# EAGLE design CntrlBoard (EAGLE 6.5.0)
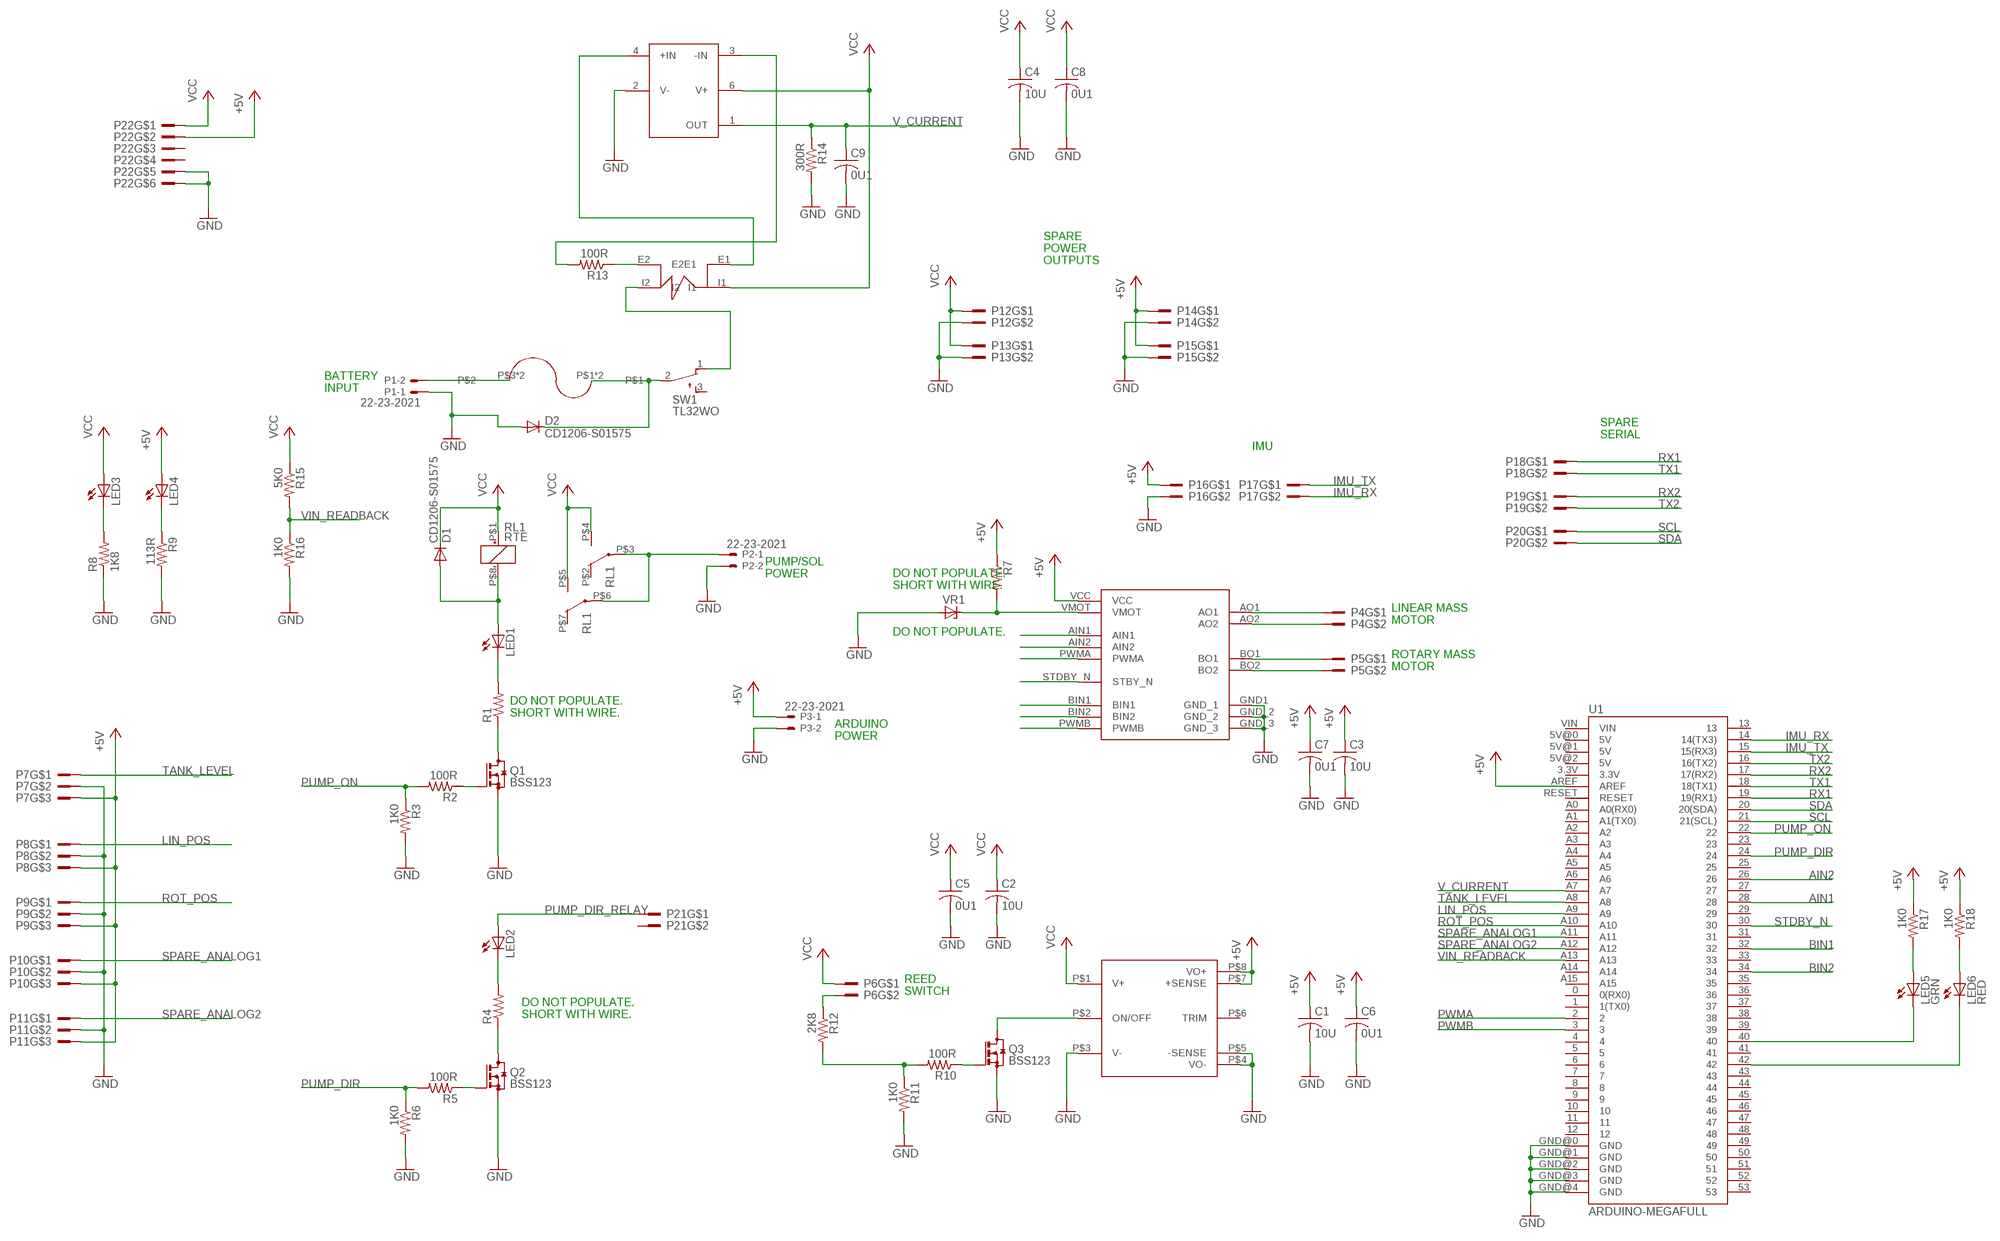
[diagram p0: schematic, sheet 1]

## Parts
C1  10U  C-USC1210K  [C1210K]
C2  10U  C-USC1210K  [C1210K]
C3  10U  C-USC1210K  [C1210K]
C4  10U  C-USC1210K  [C1210K]
C5  0U1  C-USC1210K  [C1210K]
C6  0U1  C-USC1210K  [C1210K]
C7  0U1  C-USC1210K  [C1210K]
C8  0U1  C-USC1210K  [C1210K]
C9  0U1  C-USC1210K  [C1210K]
D1  CD1206-S01575  [CD1206]
D2  CD1206-S01575  [CD1206]
LED1  LEDCHIPLED_1206  [CHIPLED_1206]
LED2  LEDCHIPLED_1206  [CHIPLED_1206]
LED3  LEDCHIPLED_1206  [CHIPLED_1206]
LED4  LEDCHIPLED_1206  [CHIPLED_1206]
LED5  GRN  LEDCHIPLED_1206  [CHIPLED_1206]
LED6  RED  LEDCHIPLED_1206  [CHIPLED_1206]
P1  22-23-2021  [22-23-2021]
P2  22-23-2021  [22-23-2021]
P3  22-23-2021  [22-23-2021]
P4  DF3A-2P-2DSA  [DF3A-2P-2DSA]
P5  DF3A-2P-2DSA  [DF3A-2P-2DSA]
P6  DF3A-2P-2DSA  [DF3A-2P-2DSA]
P7  3MM2MMLOCKING  [3PIN_2MMLOCKING]
P8  3MM2MMLOCKING  [3PIN_2MMLOCKING]
P9  3MM2MMLOCKING  [3PIN_2MMLOCKING]
P10  3MM2MMLOCKING  [3PIN_2MMLOCKING]
P11  3MM2MMLOCKING  [3PIN_2MMLOCKING]
P12  DF3A-2P-2DSA  [DF3A-2P-2DSA]
P13  DF3A-2P-2DSA  [DF3A-2P-2DSA]
P14  DF3A-2P-2DSA  [DF3A-2P-2DSA]
P15  DF3A-2P-2DSA  [DF3A-2P-2DSA]
P16  DF3A-2P-2DSA  [DF3A-2P-2DSA]
P17  DF3A-2P-2DSA  [DF3A-2P-2DSA]
P18  DF3A-2P-2DSA  [DF3A-2P-2DSA]
P19  DF3A-2P-2DSA  [DF3A-2P-2DSA]
P20  DF3A-2P-2DSA  [DF3A-2P-2DSA]
P21  DF3A-2P-2DSA  [DF3A-2P-2DSA]
P22  6PIN2ROWARDUINO  [6PIN2ROWARDUINO]
PS1  KHHD006A0A41Z  [KHHD006A0A41Z]
Q1  BSS123  [SOT23]
Q2  BSS123  [SOT23]
Q3  BSS123  [SOT23]
R1  R-US_R1206  [R1206]
R2  100R  R-US_R1206  [R1206]
R3  1K0  R-US_R1206  [R1206]
R4  R-US_R1206  [R1206]
R5  100R  R-US_R1206  [R1206]
R6  1K0  R-US_R1206  [R1206]
R7  R-US_R1206  [R1206]
R8  1K8  R-US_R1210  [R1210]
R9  113R  R-US_R1206  [R1206]
R10  100R  R-US_R1206  [R1206]
R11  1K0  R-US_R1206  [R1206]
R12  2K8  R-US_R1206  [R1206]
R13  100R  R-US_R1206  [R1206]
R14  300R  R-US_R1206  [R1206]
R15  5K0  R-US_R1206  [R1206]
R16  1K0  R-US_R1206  [R1206]
R17  1K0  R-US_R1206  [R1206]
R18  1K0  R-US_R1206  [R1206]
RL1  RTE  [RTE]
SW1  TL32WO  [TL3XWO]
U1  ARDUINO-MEGAFULL  [ARDUINO_MEGA]
U$1  ATC_FUSE_HOLDER  [FUSE_HOLDER_ATC]
U$2  POLOLU713  [POLOLU713]
U$3  RSHUNT  [CM2512SHUNT]
U$4  LT6106  [TSOT23-6]
VR1  ZENER-DIODESOT23  [SOT23]

## Nets
+5V: C1.1 C3.1 C6.1 C7.1 LED4.A P3.1 P7.P$3 P8.P$3 P9.P$3 P10.P$3 P11.P$3 P14.P$1 P15.P$1 P16.P$1 P22.P$2 PS1.P$7(+SENSE) PS1.P$8(VO+) R7.1 R17.1 R18.1 U1.AREF U$2.VCC
AIN1: U1.28 U$2.AIN1
AIN2: U1.26 U$2.AIN2
BIN1: U1.32 U$2.BIN1
BIN2: U1.34 U$2.BIN2
GND: C1.2 C2.2 C3.2 C4.2 C5.2 C6.2 C7.2 C8.2 C9.2 D2.A P1.1 P2.2 P3.2 P7.P$2 P8.P$2 P9.P$2 P10.P$2 P11.P$2 P12.P$2 P13.P$2 P14.P$2 P15.P$2 P16.P$2 P22.P$5 P22.P$6 PS1.P$3(V-) PS1.P$4(VO-) PS1.P$5(-SENSE) Q1.2(S) Q2.2(S) Q3.2(S) R3.2 R6.2 R8.1 R9.2 R11.2 R14.2 R16.2 U1.GND@0(GND) U1.GND@1(GND) U1.GND@2(GND) U1.GND@3(GND) U1.GND@4(GND) U$2.GND1(GND_1) U$2.GND_2 U$2.GND_3 U$4.2(V-) VR1.1(A)
IMU_RX: P17.P$2 U1.14(14(TX3))
IMU_TX: P17.P$1 U1.15(15(RX3))
LIN_POS: P8.P$1 U1.A9
N$1: P1.2 U$1.P$3 U$1.P$4
N$2: D1.A LED1.A RL1.P$8(-)
N$3: LED5.C U1.40
N$4: P2.1 RL1.P$3(P) RL1.P$6(P)
N$5: LED1.C R1.2
N$6: Q1.3(D) R1.1
N$7: Q2.3(D) R4.1
N$8: Q1.1(G) R2.1
N$9: LED2.C R4.2
N$10: LED4.C R9.1
N$11: Q2.1(G) R5.1
N$12: LED3.C R8.2
N$13: R10.2 R11.1 R12.2
N$14: Q3.1(G) R10.1
N$15: P6.P$2 R12.1
N$16: PS1.P$2(ON/OFF) Q3.3(D)
N$17: P4.P$1 U$2.AO1
N$18: P4.P$2 U$2.AO2
N$19: P5.P$1 U$2.BO1
N$20: P5.P$2 U$2.BO2
N$21: R7.2 U$2.VMOT VR1.3(C)
N$22: SW1.1(O) U$3.I2
N$23: LED6.C U1.42
N$24: R13.1 U$3.E2
N$25: R13.2 U$4.3(-IN)
N$26: U$3.E1 U$4.4(+IN)
N$27: D2.K(C) SW1.2(P) U$1.P$1 U$1.P$2
N$28: LED5.A R17.2
N$29: LED6.A R18.2
PUMP_DIR: R5.2 R6.1 U1.24
PUMP_DIR_RELAY: LED2.A P21.P$1
PUMP_ON: R2.2 R3.1 U1.22
PWMA: U1.2 U$2.PWMA
PWMB: U1.3 U$2.PWMB
ROT_POS: P9.P$1 U1.A10
RX1: P18.P$1 U1.19(19(RX1))
RX2: P19.P$1 U1.17(17(RX2))
SCL: P20.P$1 U1.21(21(SCL))
SDA: P20.P$2 U1.20(20(SDA))
SPARE_ANALOG1: P10.P$1 U1.A11
SPARE_ANALOG2: P11.P$1 U1.A12
STDBY_N: U1.30 U$2.STDBY_N(STBY_N)
TANK_LEVEL: P7.P$1 U1.A8
TX1: P18.P$2 U1.18(18(TX1))
TX2: P19.P$2 U1.16(16(TX2))
V_CURRENT: C9.1 R14.1 U1.A7 U$4.1(OUT)
VCC: C2.1 C4.1 C5.1 C8.1 D1.K(C) LED3.A P6.P$1 P12.P$1 P13.P$1 P22.P$1 PS1.P$1(V+) R15.1 RL1.P$1(+) RL1.P$4(S) RL1.P$5(S) U$3.I1 U$4.6(V+)
VIN_READBACK: R15.2 R16.1 U1.A13
Unconnected: P21.P$2 P22.P$3 P22.P$4 PS1.P$6(TRIM) RL1.P$2(O) RL1.P$7(O) SW1.3(S) U1.0(0(RX0)) U1.1(1(TX0)) U1.3.3V U1.4 U1.5 U1.5V@0(5V) U1.5V@1(5V) U1.5V@2(5V) U1.6 U1.7 U1.8 U1.9 U1.10 U1.11 U1.12 U1.13 U1.23 U1.25 U1.27 U1.29 U1.31 U1.33 U1.35 U1.36 U1.37 U1.38 U1.39 U1.41 U1.43 U1.44 U1.45 U1.46 U1.47 U1.48 U1.49 U1.50 U1.51 U1.52 U1.53 U1.A0(A0(RX0)) U1.A1(A1(TX0)) U1.A2 U1.A3 U1.A4 U1.A5 U1.A6 U1.A14 U1.A15 U1.RESET U1.VIN

## Notes on the sheet
- SPARE
  POWER
  OUTPUTS
- BATTERY
  INPUT
- SPARE
  SERIAL
- IMU
- PUMP/SOL
  POWER
- DO NOT POPULATE.
  SHORT WITH WIRE.
- LINEAR MASS
  MOTOR
- DO NOT POPULATE.
- ROTARY MASS
  MOTOR
- DO NOT POPULATE.
  SHORT WITH WIRE.
- ARDUINO
  POWER
- REED
  SWITCH
- DO NOT POPULATE.
  SHORT WITH WIRE.

## Library data of the parts
C1-C9 = resistor:C-US: CAPACITOR, American symbol
D1 D2 = diode:CD1206-S01575
LED1-LED6 = led:LED: LED OSRAM: - CHIPLED LG R971, LG N971, LY N971, LG Q971, LY Q971, LO R971, LY R971 LH N974, LH R974 LS Q976, LO Q976, LY Q976 LO Q996 - Hyper CHIPLED LW Q18S LB Q993, LB Q99A, LB R99A - SideLED LS A670, LO A670, LY A670, LG A670, LP A670 LB A673, LV A673, LT A673, LW A673 LH A674 LY A675 LS A676, LA A676, LO A676, LY A676, LW A676 LS A679, LY A679, LG A679 - Hyper Micro SIDELED® LS Y876, LA Y876, LO Y876, LY Y876 LT Y87S - SmartLED LW L88C, LW L88S LB L89C, LB L89S, LG L890 LS L89K, LO L89K, LY L89K LS L896, LA L896, LO L896, LY L896 - TOPLED LS T670, LO T670, LY T670, LG T670, LP T670 LSG T670, LSP T670, LSY T670, LOP T670, LYG T670 LG T671, LOG T671, LSG T671 LB T673, LV T673, LT T673, LW T673 LH T674 LS T676, LA T676, LO T676, LY T676, LB T676, LH T676, LSB T676, LW T676 LB T67C, LV T67C, LT T67C, LS T67K, LO T67K, LY T67K, LW E67C LS E67B, LA E67B, LO E67B, LY E67B, LB E67C, LV E67C, LT E67C LW T67C LS T679, LY T679, LG T679 LS T770, LO T770, LY T770, LG T770, LP T770 LB T773, LV T773, LT T773, LW T773 LH T774 LS E675, LA E675, LY E675, LS T675 LS T776, LA T776, LO T776, LY T776, LB T776 LHGB T686 LT T68C, LB T68C - Hyper Mini TOPLED® LB M676 - Mini TOPLED Santana® LG M470 LS M47K, LO M47K, LY M47K Source: http://www.osram.convergy.de LUXEON: - LUMILED® LXK2-PW12-R00, LXK2-PW12-S00, LXK2-PW14-U00, LXK2-PW14-V00 LXK2-PM12-R00, LXK2-PM12-S00, LXK2-PM14-U00 LXK2-PE12-Q00, LXK2-PE12-R00, LXK2-PE12-S00, LXK2-PE14-T00, LXK2-PE14-U00 LXK2-PB12-K00, LXK2-PB12-L00, LXK2-PB12-M00, LXK2-PB14-N00, LXK2-PB14-P00, LXK2-PB14-Q00 LXK2-PR12-L00, LXK2-PR12-M00, LXK2-PR14-Q00, LXK2-PR14-R00 LXK2-PD12-Q00, LXK2-PD12-R00, LXK2-PD12-S00 LXK2-PH12-R00, LXK2-PH12-S00 LXK2-PL12-P00, LXK2-PL12-Q00, LXK2-PL12-R00 Source: www.luxeon.com KINGBRIGHT: KA-3528ASYC Source: www.kingbright.com
P1-P3 = con-molex:22-23-2021: .100" (2.54mm) Center Header - 2 Pin; MF: MOLEX; MPN: 22-23-2021; OC_FARNELL: 1462926; OC_NEWARK: 25C3832
P4-P6 P12-P21 = con-3m:DF3A-2P-2DSA
P7-P11 = con-3m:3MM2MMLOCKING
P22 = con-3m:6PIN2ROWARDUINO
PS1 = dc-dc-converter:KHHD006A0A41Z
Q1-Q3 = transistor-small-signal:BSS123: N-CHANNEL MOS FET
R1-R18 = resistor:R-US_: RESISTOR, American symbol
RL1 = relay:RTE
SW1 = switch:TL32WO: TINY SWITCH ON - MOM Source: http://www2.produktinfo.conrad.com/datenblaetter/700000-724999/705152-da-01-de-Subminiaturschalter_TL_36WO.pdf
U1 = SparkFun-Boards:ARDUINO-MEGA: Arduino Mega board footprint
U$1 = fuse:ATC_FUSE_HOLDER
U$2 = adafruit:POLOLU713
U$3 = resistor:RSHUNT
U$4 = linear-technology:LT6106
VR1 = diode:ZENER-DIODE: Z-Diode

## Board
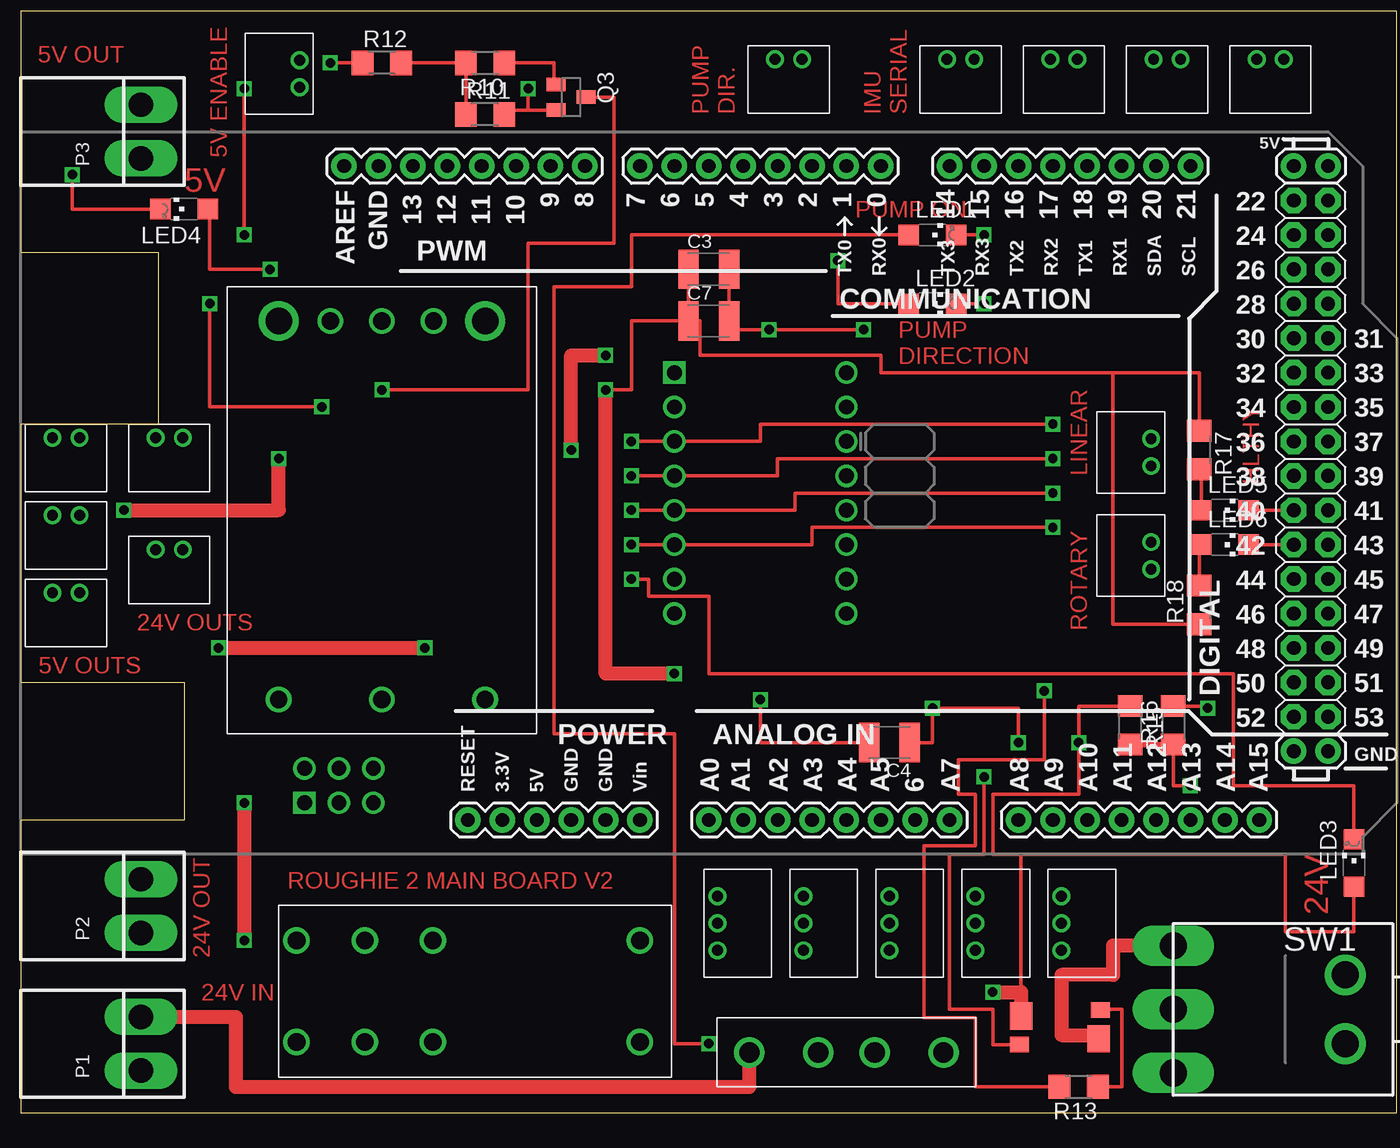
[diagram p1: board, top side]
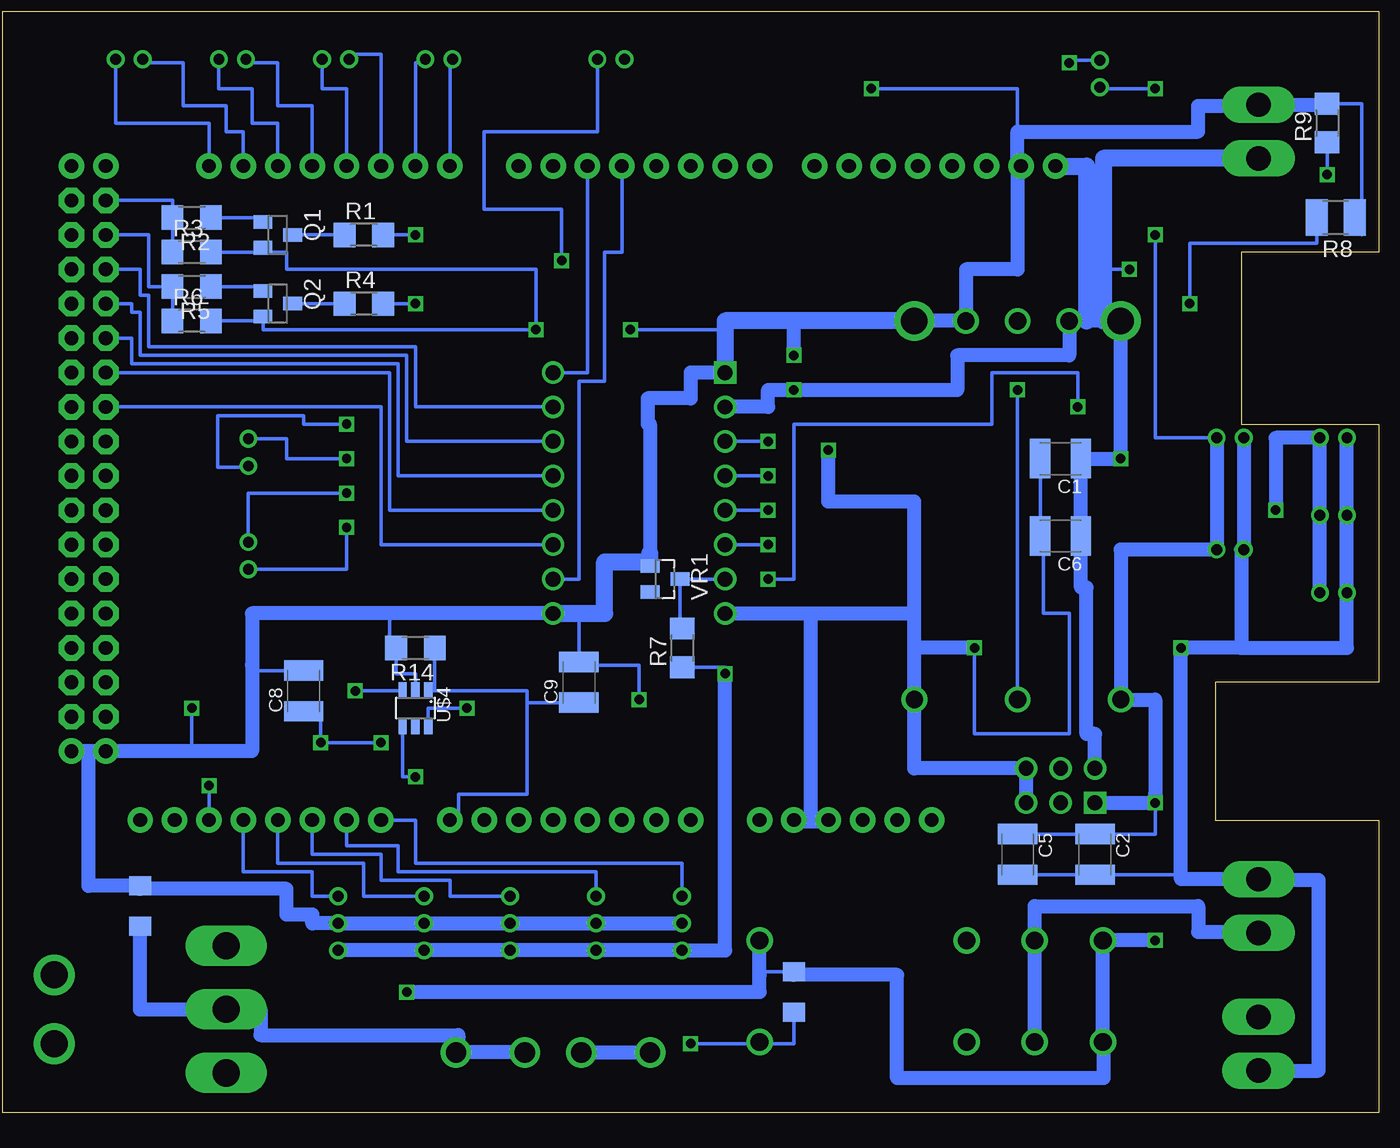
[diagram p2: board, bottom side, seen from below]

No outline drawn. Coordinates in mm, seen from the top.
Copper layers (1*16): Top 0.035mm / dielectric 1.5mm / Bottom 0.035mm
Design rules "default *": minimum track width 10mil, minimum drill 24mil, track to track 10mil, track to pad 10mil, pad to pad 10mil, via to via 10mil, smd to smd 10mil, copper to edge 40mil, drill to drill 10mil, minimum pad ring 10mil, minimum via ring 8mil, stop-mask expansion 4mil, vias tented up to drill 0mil, thermal gap 10mil
Milling: 12 lines

### Footprints (pad centres in the part's own frame; a part is rotated, then mirrored left to right if it is on the bottom)
C1210K = smd 1.5 x 2.9: 1 -1.5,0; 2 1.5,0
CD1206 = smd 1.397 x 1.6: A -1.499,0; K 1.499,0
CHIPLED_1206 = smd 1.5 x 1.5: A 0,-1.75; C 0,1.75
22-23-2021 = drill 1.801 long: 1 -1.981,0; 2 1.981,0
DF3A-2P-2DSA = drill 0.8: P$1 2,1.001; P$2 4,1.001
3PIN_2MMLOCKING = drill 0.8: P$1 -2,0; P$2 0,0; P$3 2,0
6PIN2ROWARDUINO = drill 1.1 square: P$1 0,0 | drill 1.1: P$2 0,2.54; P$3 2.54,0; P$4 2.54,2.54; P$5 5.08,0; P$6 5.08,2.54
KHHD006A0A41Z = drill 1.27: P$1 2.54,19.05; P$2 2.54,11.43; P$3 2.54,3.81; P$5 30.48,7.62; P$6 30.48,11.43; P$7 30.48,15.24 | drill 1.956: P$4 30.48,3.81; P$8 30.48,19.05
SOT23 = smd 1 x 1.4: 1 -0.95,-1.1; 2 0.95,-1.1; 3 0,1.1
R1206 = smd 1.6 x 1.803: 1 -1.422,0; 2 1.422,0
R1210 = smd 1.6 x 2.7: 1 -1.4,0; 2 1.4,0
RTE = drill 1.3: P$1 0,0; P$2 15.291,0; P$3 20.32,0; P$4 25.349,0; P$5 25.349,7.493; P$6 20.32,7.493; P$7 15.291,7.493; P$8 0,7.493
TL3XWO = drill 1.999 long: 1 -4.699,-12.7; 2 0,-12.7; 3 4.699,-12.7 | drill 1.999: M1 -2.54,0; M2 2.54,0
ARDUINO_MEGA = drill 1.016 pad 1.88: 0 63.5,50.8; 1 60.96,50.8; 2 58.42,50.8; 3 55.88,50.8; 3.3V 35.56,2.54; 4 53.34,50.8; 5 50.8,50.8; 5V@0 38.1,2.54; 5V@1 93.98,50.8; 5V@2 96.52,50.8; 6 48.26,50.8; 7 45.72,50.8; 8 41.656,50.8; 9 39.116,50.8; 10 36.576,50.8; 11 34.036,50.8; 12 31.496,50.8; 13 28.956,50.8; 14 68.58,50.8; 15 71.12,50.8; 16 73.66,50.8; 17 76.2,50.8; 18 78.74,50.8; 19 81.28,50.8; 20 83.82,50.8; 21 86.36,50.8; A0 50.8,2.54; A1 53.34,2.54; A2 55.88,2.54; A3 58.42,2.54; A4 60.96,2.54; A5 63.5,2.54; A6 66.04,2.54; A7 68.58,2.54; A8 73.66,2.54; A9 76.2,2.54; A10 78.74,2.54; A11 81.28,2.54; A12 83.82,2.54; A13 86.36,2.54; A14 88.9,2.54; A15 91.44,2.54; AREF 23.876,50.8; GND@0 40.64,2.54; GND@1 43.18,2.54; GND@2 93.98,7.62; GND@3 96.52,7.62; GND@4 26.416,50.8; RESET 33.02,2.54; VIN 45.72,2.54 | drill 1.016 pad 1.88 octagon: 22 93.98,48.26; 23 96.52,48.26; 24 93.98,45.72; 25 96.52,45.72; 26 93.98,43.18; 27 96.52,43.18; 28 93.98,40.64; 29 96.52,40.64; 30 93.98,38.1; 31 96.52,38.1; 32 93.98,35.56; 33 96.52,35.56; 34 93.98,33.02; 35 96.52,33.02; 36 93.98,30.48; 37 96.52,30.48; 38 93.98,27.94; 39 96.52,27.94; 40 93.98,25.4; 41 96.52,25.4; 42 93.98,22.86; 43 96.52,22.86; 44 93.98,20.32; 45 96.52,20.32; 46 93.98,17.78; 47 96.52,17.78; 48 93.98,15.24; 49 96.52,15.24; 50 93.98,12.7; 51 96.52,12.7; 52 93.98,10.16; 53 96.52,10.16
FUSE_HOLDER_ATC = drill 1.5: P$1 -7.163,0; P$2 -2.083,0; P$3 2.083,0; P$4 7.163,0
POLOLU713 = drill 1.1: AIN1 13.97,13.97; AIN2 13.97,16.51; AO1 1.27,13.97; AO2 1.27,11.43; BIN1 13.97,8.89; BIN2 13.97,6.35; BO1 1.27,6.35; BO2 1.27,8.89; GND_2 1.27,1.27; GND_3 13.97,1.27; PWMA 13.97,19.05; PWMB 13.97,3.81; STDBY_N 13.97,11.43; VCC 1.27,16.51; VMOT 1.27,3.81 | drill 1.1 square: GND1 1.27,19.05
CM2512SHUNT = smd 1.397 x 1.143: E1 0.699,0.572; E2 6.668,3.111 | smd 1.651 x 2.007: I1 0.826,2.68; I2 6.54,1.003
TSOT23-6 = smd 0.62 x 1.22: 1 -0.95,-1.3; 2 0,-1.3; 3 0.95,-1.3; 4 0.95,1.3; 5 0,1.3; 6 -0.95,1.3

### Placement (x,y rotation side)
C1  23.5,48.26 180 bottom
C2  20.95,19.05 270 bottom
C3  50.8,62.23 0 top
C4  64.14,27.3 180 top
C5  26.67,19.05 270 bottom
C6  23.5,42.55 180 bottom
C7  50.8,58.42 0 top
C8  79.38,31.11 90 bottom
C9  59.05,31.75 90 bottom
D1  43.18,8.89 90 bottom
D2  91.44,15.24 270 bottom
LED1  67.31,64.77 270 top
LED2  67.31,59.69 270 top
LED3  98.42,18.41 0 top
LED4  12.06,66.67 90 top
LED5  88.9,44.45 270 top
LED6  88.9,41.91 270 top
P1  8.89,5.08 90 top
P2  8.89,15.24 90 top
P3  8.89,72.39 90 top
P4  84.45,45.72 90 top
P5  84.45,38.1 90 top
P6  21.59,73.66 90 top
P7  51.44,13.97 270 top
P8  57.78,13.97 270 top
P9  64.14,13.97 270 top
P10  70.48,13.97 270 top
P11  76.83,13.97 270 top
P12  13.97,42.55 180 top
P13  13.97,50.8 180 top
P14  6.35,50.8 180 top
P15  6.35,39.37 180 top
P16  6.35,45.09 180 top
P17  72.39,78.74 180 top
P18  87.63,78.74 180 top
P19  80.01,78.74 180 top
P20  95.25,78.74 180 top
P21  59.69,78.74 180 top
P22  20.95,22.86 0 top
PS1  38.1,27.94 90 top
Q1  81.28,64.77 270 bottom
Q2  81.28,59.69 270 bottom
Q3  40.64,74.93 270 top
R1  74.93,64.77 0 bottom
R2  87.63,66.04 180 bottom
R3  87.63,63.5 0 bottom
R4  74.93,59.69 0 bottom
R5  87.63,60.96 180 bottom
R6  87.63,58.42 0 bottom
R7  51.44,34.29 90 bottom
R8  3.17,66.04 180 bottom
R9  3.81,73.03 90 bottom
R10  34.29,77.47 180 top
R11  34.29,73.66 0 top
R12  26.67,77.47 0 top
R13  78.11,1.91 180 top
R14  71.12,34.29 180 bottom
R15  81.92,28.57 270 top
R16  85.09,28.57 90 top
R17  87,48.9 270 top
R18  87,37.47 90 top
RL1  45.72,12.7 180 top
SW1  97.79,7.62 270 top
U1  0,19.05 0 top
U$1  60.96,4.45 180 top
U$2  46.99,35.56 0 top
U$3  73.03,4.45 0 top
U$4  71.12,29.84 180 bottom
VR1  52.7,39.37 270 bottom

### Tracks (layer width: path | path; a pad name or v marks a point on that pad's centre or on a via)
+5V  (via drill 0.7)
  Top 0.254: v18.41,62.23 13.97,62.23 13.97,66.67 LED4.A | C3.1 C7.1 | C7.1 45.09,58.42 45.09,53.34 v43.18,53.34 | R17.1 87,54.61 80.64,54.61 | 80.64,54.61 63.5,54.61 63.5,55.88 50.16,55.88 50.16,58.42 C7.1 | R18.1 80.64,36.04 80.64,54.61
  Top 1.016: v48.26,32.38 43.18,32.38 v43.18,53.34 | v7.62,44.45 19.05,44.45 v19.05,48.26
  Bottom 0.254: v18.41,62.23 20.32,62.23 | R7.1 48.26,32.87 v48.26,32.38
  Bottom 1.016: 20.32,58.42 21.59,58.42 PS1.P$7 22.86,55.88 31.11,55.88 31.11,53.34 v43.18,53.34 45.09,53.34 45.09,52.07 U$2.VCC | v48.26,32.38 48.26,11.97 P7.P$3 P8.P$3 P9.P$3 P10.P$3 P11.P$3 | P15.P$1 P16.P$1 P14.P$1 7.62,49.8 v7.62,44.45 | 19.05,59.05 PS1.P$8 v19.05,48.26 C1.1 C6.1 22,38.73 21.59,38.73 21.59,27.94 20.95,27.94 P22.P$2
  Bottom 1.27: PS1.P$8 20.32,58.42 20.32,62.23 20.32,70.41 P3.1 | U1.AREF 21.59,69.85 21.59,58.42
AIN1
  Bottom 0.254: U1.28 92.08,59.69 92.08,59.05 91.44,59.05 91.44,55.88 71.75,55.88 71.75,49.53 U$2.AIN1
AIN2
  Bottom 0.254: U1.26 91.44,62.23 91.44,60.33 90.81,60.33 90.81,56.52 71.12,56.52 71.12,52.07 U$2.AIN2
BIN1
  Bottom 0.254: U1.32 73.03,54.61 73.03,44.45 U$2.BIN1
BIN2
  Bottom 0.254: U1.34 73.66,52.07 73.66,41.91 U$2.BIN2
GND  (via drill 0.7)
  Top 0.254: R11.2 35.71,73.98 37.47,73.98 | Q3.2 37.47,73.98 | 37.47,73.98 v37.47,75.56 | v62.23,57.78 v55.24,57.78 52.7,57.78 52.7,58.42 C7.2 C3.2 | C4.2 54.61,27.3 v54.61,30.48 | R16.2 87.63,30 v87.63,29.84
  Top 1.016: v40.64,48.9 40.64,55.88 v43.18,55.88 | v14.61,34.29 v29.84,34.29
  Bottom 0.254: R3.2 82.38,63.5 | 82.38,63.5 Q1.2 | R6.2 82.38,58.42 Q2.2 82.38,57.78 v62.23,57.78 62.23,62.23 80.64,62.23 80.64,63.5 82.38,63.5 | v37.47,75.56 26.67,75.56 26.67,72.39 | v55.24,57.78 48.26,57.78 | R9.2 1.27,74.45 1.27,64.77 R8.1 | 73.03,36.83 73.03,34.29 R14.2 72.54,32.38 71.12,32.38 U$4.2 | 59.05,36.83 C9.2 59.05,33.02 54.61,33.02 v54.61,30.48 | C8.2 83.19,32.62 83.19,33.02 | C1.2 C6.2 24.77,42.55 24.77,36.83 22.86,36.83 22.86,27.94 29.84,27.94 v29.84,34.29 | C5.2 C2.2 14.61,17.55 | v87.63,29.84 87.63,26.67
  Bottom 1.016: PS1.P$4 PS1.P$5 30.48,62.23 26.67,62.23 26.67,69.85 | P3.2 8.26,74.37 | 8.26,74.37 3.66,74.37 R9.2 | U1.GND@4 26.67,69.85 | 26.67,69.85 26.67,72.39 13.34,72.39 13.34,74.3 8.26,74.3 8.26,74.37 | 95.25,26.67 U1.GND@2 87.63,26.67 83.19,26.67 83.19,33.02 83.19,36.83 73.03,36.83 U$2.GND_3 | 95.25,26.67 U1.GND@3 | U$2.GND1 50.8,54.61 50.8,52.7 53.98,52.7 53.98,50.8 53.8,50.8 53.8,41.27 VR1.1 | 34.29,34.29 PS1.P$3 34.29,25.4 P22.P$6 P22.P$5 | 34.29,34.29 34.29,36.83 | 34.29,36.83 34.29,45.09 40.64,45.09 v40.64,48.9 | v43.18,55.88 43.18,58.42 | U$2.GND_2 41.91,36.83 | 41.91,36.83 34.29,36.83 | U1.GND@0 41.91,21.59 41.91,36.83 | P1.1 4.45,3.1 4.45,17.14 8.89,17.14 P2.2 14.61,17.22 14.61,17.55 v14.61,34.29 10.16,34.29 | P14.P$2 P16.P$2 P15.P$2 2.35,34.29 10.16,34.29 | 10.16,34.29 10.16,41.54 P12.P$2 P13.P$2 | v29.84,34.29 34.29,34.29 | P7.P$2 P8.P$2 P9.P$2 P10.P$2 P11.P$2 78.74,13.97 78.74,14.61 80.64,14.61 80.64,16.51 91.44,16.51 D2.A 95.25,16.74 95.25,26.67
  Bottom 1.27: U1.GND@0 U1.GND@1 | PS1.P$4 43.18,58.42 48.26,58.42 48.26,57.78 U$2.GND1 | U$2.GND_3 59.05,36.83 57.15,36.83 57.15,40.64 53.8,40.64 53.8,41.27
IMU_RX
  Bottom 0.254: P17.P$2 68.58,77.74 U1.14
IMU_TX
  Bottom 0.254: U1.15 71.12,77.47 70.39,77.47 P17.P$1
LIN_POS
  Bottom 0.254: U1.A9 76.2,19.68 72.39,19.68 72.39,17.78 57.78,17.78 P8.P$1
N$1
  Top 1.016: P1.2 15.88,7.06 15.88,1.91 53.8,1.91 U$1.P$4
  Bottom 1.016: U$1.P$3 U$1.P$4
N$2  (via drill 0.7)
  Top 0.254: LED1.A 45.09,64.77 45.09,60.96 39.37,60.96 39.37,27.94 48.26,27.94 48.26,5.08 v50.8,5.08
  Bottom 0.254: D1.A 43.18,5.08 45.72,5.08 | v50.8,5.08 45.72,5.08 | 45.72,5.08 RL1.P$8
N$3
  Top 0.254: U1.40 LED5.C
N$4
  Bottom 1.016: RL1.P$6 RL1.P$3 25.4,15.24 13.34,15.24 13.34,13.34 8.89,13.34 P2.1
N$5  (via drill 0.7)
  Top 0.254: v71.12,64.77 LED1.C
  Bottom 0.254: R1.2 v71.12,64.77
N$6
  Bottom 0.254: Q1.3 R1.1
N$7
  Bottom 0.254: Q2.3 R4.1
N$8
  Bottom 0.254: R2.1 82.38,66.04 Q1.1
N$9  (via drill 0.7)
  Top 0.254: v71.12,59.69 LED2.C
  Bottom 0.254: R4.2 v71.12,59.69
N$10  (via drill 0.7)
  Top 0.254: LED4.C 3.81,66.67 v3.81,69.22
  Bottom 0.254: v3.81,69.22 R9.1
N$11
  Bottom 0.254: R5.1 82.38,60.96 Q2.1
N$12  (via drill 0.7)
  Top 0.254: LED3.C 98.42,24.13 89.53,24.13 89.53,32.38 50.8,32.38 50.8,38.1 46.35,38.1 46.35,39.37 v45.09,39.37 | v22.23,52.07 13.97,52.07 v13.97,59.69
  Bottom 0.254: v45.09,39.37 43.18,39.37 43.18,50.8 28.57,50.8 28.57,54.61 22.23,54.61 v22.23,52.07 | v13.97,59.69 13.97,64.14 4.58,64.14 R8.2
N$13
  Top 0.254: R12.2 R10.2 R11.1
N$14
  Top 0.254: Q3.1 39.37,75.88 39.37,77.47 R10.1
N$15  (via drill 0.7)
  Top 0.254: v22.86,77.47 R12.1
  Bottom 0.254: P6.P$2 22.86,77.66 v22.86,77.47
N$16  (via drill 0.7)
  Top 0.254: Q3.3 43.81,74.93 43.81,64.14 37.47,64.14 37.47,53.34 v26.67,53.34
  Bottom 0.254: v26.67,53.34 PS1.P$2
N$17  (via drill 0.7)
  Top 0.254: v45.09,49.53 54.61,49.53 54.61,50.8 v76.2,50.8
  Bottom 0.254: U$2.AO1 v45.09,49.53 | v76.2,50.8 79.38,50.8 79.38,51.44 85.72,51.44 85.72,47.62 83.45,47.62 P4.P$1
N$18  (via drill 0.7)
  Top 0.254: v45.09,46.99 55.88,46.99 55.88,48.26 v76.2,48.26
  Bottom 0.254: U$2.AO2 v45.09,46.99 | P4.P$2 80.64,49.72 80.64,48.26 v76.2,48.26
N$19  (via drill 0.7)
  Top 0.254: v45.09,41.91 58.42,41.91 58.42,43.18 v76.2,43.18
  Bottom 0.254: U$2.BO1 v45.09,41.91 | P5.P$1 76.2,40.1 v76.2,43.18
N$20  (via drill 0.7)
  Top 0.254: v45.09,44.45 57.15,44.45 57.15,45.72 v76.2,45.72
  Bottom 0.254: U$2.BO2 v45.09,44.45 | v76.2,45.72 83.45,45.72 P5.P$2
N$21
  Bottom 0.254: U$2.VMOT VR1.3 51.6,35.71 R7.2
N$22
  Top 1.016: SW1.1 80.64,12.32 80.64,10.16 76.83,10.16 76.83,5.71 79.57,5.71 U$3.I2
N$23
  Top 0.254: U1.42 LED6.C
N$24
  Top 0.254: R13.1 81.28,1.91 81.28,7.62 79.69,7.62 U$3.E2
N$25  (via drill 0.7)
  Top 0.254: R13.2 70.48,1.91 70.48,6.99 66.67,6.99 66.67,19.68 70.48,19.68 70.48,23.5 69.22,23.5 69.22,26.04 75.56,26.04 v75.56,31.11
  Bottom 0.254: v75.56,31.11 72.07,31.11 U$4.3
N$26  (via drill 0.7)
  Top 0.254: U$3.E1 71.75,5.02 71.75,7.62 68.58,7.62 68.58,19.05 71.12,19.05 v71.12,24.77
  Bottom 0.254: v71.12,24.77 72.07,24.77 U$4.4
N$27
  Bottom 1.016: U$1.P$2 U$1.P$1 67.94,5.71 82.55,5.71 82.55,7.62 SW1.2 91.44,7.62 D2.K
N$28
  Top 0.254: R17.2 87.15,47.47 LED5.A
N$29
  Top 0.254: LED6.A 87,41.91 R18.2
PUMP_DIR
  Bottom 0.254: U1.24 90.81,64.77 90.81,60.96 R5.2 R6.1
PUMP_DIR_RELAY  (via drill 0.7)
  Top 0.254: LED2.A 60.33,59.69 v60.33,62.87
  Bottom 0.254: v60.33,62.87 60.33,66.67 66.04,66.67 66.04,72.39 57.69,72.39 P21.P$1
PUMP_ON
  Bottom 0.254: U1.22 89.05,67.31 R2.2 R3.1
PWMA
  Bottom 0.254: U$2.PWMA 58.42,54.61 U1.2
PWMB
  Bottom 0.254: U$2.PWMB 59.05,39.37 59.05,53.98 57.15,53.98 57.15,63.5 55.88,63.5 U1.3
ROT_POS
  Bottom 0.254: P9.P$1 68.58,15.97 68.58,17.14 73.66,17.14 73.66,19.05 78.74,19.05 U1.A10
RX1
  Bottom 0.254: U1.19 81.28,73.03 83.19,73.03 83.19,75.56 85.63,75.56 P18.P$1
RX2
  Bottom 0.254: U1.17 76.2,75.56 78.01,75.56 P19.P$1
SCL
  Bottom 0.254: U1.21 86.36,73.03 93.25,73.03 P20.P$1
SDA
  Bottom 0.254: U1.20 83.82,72.39 85.09,72.39 85.09,74.3 88.27,74.3 88.27,77.47 91.25,77.47 P20.P$2
SPARE_ANALOG1
  Bottom 0.254: P10.P$1 74.93,15.97 74.93,18.41 81.28,18.41 U1.A11
SPARE_ANALOG2
  Bottom 0.254: P11.P$1 78.74,15.97 78.74,17.78 83.82,17.78 U1.A12
STDBY_N
  Bottom 0.254: U1.30 92.08,57.15 92.08,55.24 72.39,55.24 72.39,46.99 U$2.STDBY_N
TANK_LEVEL
  Bottom 0.254: P7.P$1 51.44,18.41 71.12,18.41 71.12,21.59 U1.A8
TX1
  Bottom 0.254: U1.18 78.74,74.3 81.28,74.3 81.28,77.47 83.63,77.47 P18.P$2
TX2
  Bottom 0.254: U1.16 73.66,78.11 76.01,78.11 P19.P$2
V_CURRENT
  Bottom 0.254: R14.1 69.7,31.14 U$4.1 70.17,31.11 62.87,31.11 62.87,30.48 62.87,30.25 | U1.A7 67.94,21.59 67.94,23.5 62.87,23.5 62.87,30.25 | C9.1 62.87,30.25
VCC  (via drill 0.7)
  Top 0.254: v16.51,64.77 v16.51,75.56 | LED3.A 98.42,13.34 93.34,13.34 93.34,19.05 73.85,19.05 | 73.85,8.89 73.85,19.05 | 73.85,19.05 71.75,19.05 71.75,23.5 78.11,23.5 v78.11,27.3 78.11,30 R15.1 | v73.66,27.3 73.66,29.84 v67.31,29.84 67.31,27.3 C4.1
  Top 1.016: v16.51,22.86 v16.51,12.7 | v71.75,8.89 73.85,8.89 U$3.I1
  Bottom 0.254: D1.K 45.72,10.39 45.72,10.16 | v16.51,64.77 16.51,49.8 P13.P$1 | v16.51,75.56 20.59,75.56 P6.P$1 | v73.66,27.3 v78.11,27.3 78.11,29.61 C8.1 | v67.31,29.84 70.17,29.84 U$4.6 | C5.1 C2.1 16.51,20.55 v16.51,22.86 | 16.51,23.73 16.51,23.5
  Bottom 1.016: RL1.P$1 45.72,10.16 45.72,8.89 v71.75,8.89 | v16.51,12.7 RL1.P$4 RL1.P$5 20.32,5.21 20.32,2.54 35.56,2.54 35.56,10.16 43.18,10.16 D1.K | P13.P$1 P12.P$1 19.05,41.54 PS1.P$1 16.51,30.48 16.51,23.5 v16.51,22.86 P22.P$1
VIN_READBACK  (via drill 0.7)
  Top 0.254: v86.36,24.13 85.09,24.13 R16.1
  Top 0.406: R15.2 R16.1
  Bottom 0.254: U1.A13 v86.36,24.13

### Text on the board
Top: 5V OUT | PUMP / DIR. | IMU / SERIAL | 5V ENABLE | 5V | PUMP ON | PUMP / DIRECTION | LINEAR | HLTHY | 24V OUTS | ROTARY | 5V OUTS | ROUGHIE 2 MAIN BOARD V2 | 24V | 24V OUT | 24V IN